# Altium project AVCI_Mk1.PrjPcb (part 1 of 3)
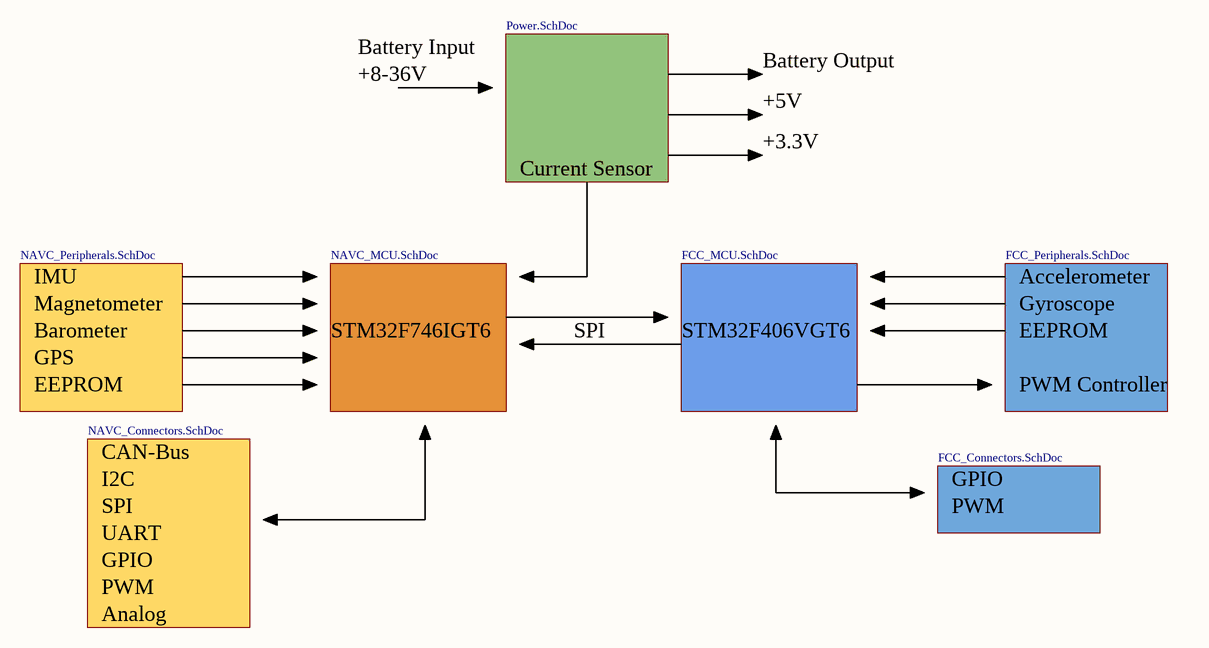
[diagram p0: Overview.SchDoc]
8 sheets, 240 parts. Net scope: flat (ports and power ports of the same name join across sheets).
Board file: AVCI_Mk1.PcbDoc
Sheets:
  Overview.SchDoc
    Designator = FCC_Connectors.SchDoc
    Designator = FCC_Peripherals.SchDoc
    Designator = NAVC_MCU.SchDoc
    Designator = NAVC_Peripherals.SchDoc
    Designator = NAVC_Connectors.SchDoc
    Designator = FCC_MCU.SchDoc
    Designator = Power.SchDoc

## Sheet Overview.SchDoc
size A4; SheetNumber: 1; SheetTotal: 8

### Sub-sheets
Designator = FCC_Connectors.SchDoc: no entries
Designator = FCC_Peripherals.SchDoc: no entries
Designator = NAVC_MCU.SchDoc: no entries
Designator = NAVC_Peripherals.SchDoc: no entries
Designator = NAVC_Connectors.SchDoc: no entries
Designator = FCC_MCU.SchDoc: no entries
Designator = Power.SchDoc: no entries

### Notes on the sheet
- +8-36V
- Battery Input
- +5V
- Battery Output
- Current Sensor
- +3.3V
- IMU
- Magnetometer
- Accelerometer
- Gyroscope
- Barometer
- GPS
- STM32F746IGT6
- SPI
- STM32F406VGT6
- EEPROM
- PWM Controller
- CAN-Bus
- I2C
- GPIO
- PWM
- UART
- Analog

## Sheet FCC_Connectors.SchDoc
size A4; SheetNumber: 7; SheetTotal: 8
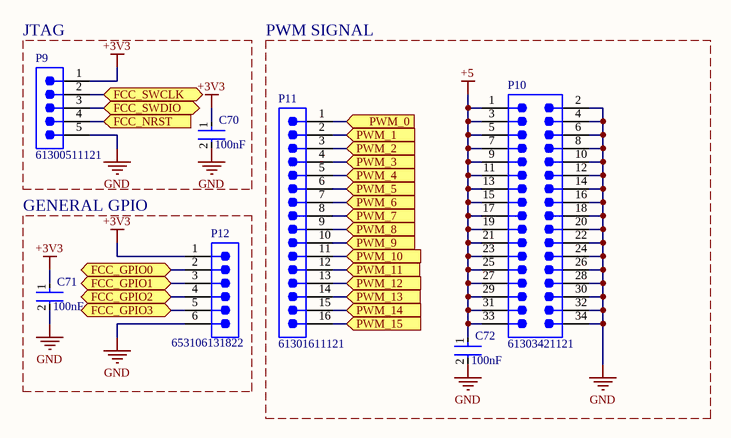
[diagram p1: FCC_Connectors.SchDoc]

### Parts
C70  100nF  [FP-CGA3E-0_3-0_1-IPC_A]
C71  100nF  [FP-CGA3E-0_3-0_1-IPC_A]
C72  100nF  [FP-CGA3E-0_3-0_1-IPC_A]
P9  61300511121  [61300511121]
P10  61303421121  [61303421121]
P11  61301611121  [61301611121]
P12  653106131822  [653106131822]

### Blocks framed on the sheet
JTAG: C70 P9
PWM SIGNAL: C72 P10 P11
GENERAL GPIO: C71 P12

### Ports
FCC_GPIO0 (bidir, see FCC_MCU[2A]), FCC_GPIO1 (bidir, see FCC_MCU[2A]), FCC_GPIO2 (bidir, see FCC_MCU[2A]), FCC_GPIO3 (bidir, see FCC_MCU[2A]), FCC_NRST (in, see FCC_MCU[3C], FCC_MCU[4A]), FCC_SWCLK (bidir, see FCC_MCU[1B]), FCC_SWDIO (bidir, see FCC_MCU[1B]), PWM_0 (in, see FCC_Peripherals[2B]), PWM_1 (in, see FCC_Peripherals[2B]), PWM_2 (in, see FCC_Peripherals[2B]), PWM_3 (in, see FCC_Peripherals[2B]), PWM_4 (in, see FCC_Peripherals[2B]), PWM_5 (in, see FCC_Peripherals[2B]), PWM_6 (in, see FCC_Peripherals[2C]), PWM_7 (in, see FCC_Peripherals[2C]), PWM_8 (in, see FCC_Peripherals[2C]), PWM_9 (in, see FCC_Peripherals[2C]), PWM_10 (in, see FCC_Peripherals[2C]), PWM_11 (in, see FCC_Peripherals[2C]), PWM_12 (in, see FCC_Peripherals[2C]), PWM_13 (in, see FCC_Peripherals[2C]), PWM_14 (in, see FCC_Peripherals[2C]), PWM_15 (in, see FCC_Peripherals[2C])

### Nets
+3V3: C70.1 C71.1 P9.1 P12.1
+5: C72.1 P10.1 P10.3 P10.5 P10.7 P10.9 P10.11 P10.13 P10.15 P10.17 P10.19 P10.21 P10.23 P10.25 P10.27 P10.29 P10.31 P10.33
GND: C70.2 C71.2 C72.2 P9.5 P10.2 P10.4 P10.6 P10.8 P10.10 P10.12 P10.14 P10.16 P10.18 P10.20 P10.22 P10.24 P10.26 P10.28 P10.30 P10.32 P10.34 P12.6
NetC54_1: P9.4 ; port FCC_NRST
NetP9_2: P9.2 ; port FCC_SWCLK
NetP9_3: P9.3 ; port FCC_SWDIO
NetP11_1: P11.1 ; port PWM_0
NetP11_2: P11.2 ; port PWM_1
NetP11_3: P11.3 ; port PWM_2
NetP11_4: P11.4 ; port PWM_3
NetP11_5: P11.5 ; port PWM_4
NetP11_6: P11.6 ; port PWM_5
NetP11_7: P11.7 ; port PWM_6
NetP11_8: P11.8 ; port PWM_7
NetP11_9: P11.9 ; port PWM_8
NetP11_10: P11.10 ; port PWM_9
NetP11_11: P11.11 ; port PWM_10
NetP11_12: P11.12 ; port PWM_11
NetP11_13: P11.13 ; port PWM_12
NetP11_14: P11.14 ; port PWM_13
NetP11_15: P11.15 ; port PWM_14
NetP11_16: P11.16 ; port PWM_15
NetP12_2: P12.2 ; port FCC_GPIO0
NetP12_3: P12.3 ; port FCC_GPIO1
NetP12_4: P12.4 ; port FCC_GPIO2
NetP12_5: P12.5 ; port FCC_GPIO3

### Library data of the parts
C70-C72 = CMP-2000-07546-2: Cap Ceramic 100nF 50V X7R 10% Pad SMD 0603 +125°C Automotive T/R; Weight: 7.1E-05oz; Composition: Ceramic; Max Operating Temperature: 125°C; Termination: SMD/SMT; Dielectric: X7R; Length: 1.6mm; Package Quantity: 1; REACH SVHC: No SVHC; Lead Free: Lead Free; Case Code (Metric): 1608; Min Operating Temperature: -55°C; Packaging: Tape and Reel; Tolerance: 10%; Voltage Rating: 50V; Case Code (Imperial): 0603; Capacitance: 100nF; Case/Package: 0603; Voltage Rating (DC): 50V; Depth: 0.8mm; Radiation Hardening: No; Ratings: AEC-Q200; Mount: Surface Mount; Voltage: 50V; Thickness: 0.035inch; Width: 0.8mm; Height: 0.8mm
P9 = CMP-1502-01068-3: NexarPartId: 32855526; Connector Type: Male Pin; Gender: Male; Contact Resistance: 20mΩ; Pitch: 2.54mm; Operating Supply Voltage: 250V; Current Rating: 3A; Number of Contacts: 5; Lead Free: Lead Free; Color: Black; Packaging: Bulk; Lead Pitch: 2.54mm; Contact Material: Copper; Min Operating Temperature: -40°C; Contact Mating Length: 5.9944mm; Voltage Rating: 250V; Number of Pins: 5; Number of Positions: 5; Height: 8.89mm; Orientation: Vertical; REACH SVHC: Unknown; RoHS: Compliant; Contact Plating: Gold; Max Operating Temperature: 105°C; Mount: Through Hole; Number of Rows: 1; Termination: Solder
P10 = CMP-1502-01127-3: NexarPartId: 32855572; Operating Supply Voltage: 250V; Number of Positions: 34; Pitch: 2.54mm; Contact Resistance: 20mΩ; Connector Type: Male Pin; Gender: Male; Current Rating: 3A; Termination: Solder; Packaging: Bulk; Number of Rows: 2; Contact Plating: Gold; Contact Material: Copper; Orientation: Vertical; Number of Contacts: 34; REACH SVHC: Unknown; RoHS: Compliant; Lead Pitch: 2.54mm; Contact Mating Length: 5.9944mm; Color: Black; Row Spacing: 2.54mm; Mount: Through Hole; Number of Pins: 34
P11 = CMP-1502-01095-4: NexarPartId: 32855548; Voltage Rating: 250V; Connector Type: Male Pin; Current Rating: 3A; Contact Resistance: 20mΩ; Number of Contacts: 16; Gender: Male; Pitch: 2.54mm; Min Operating Temperature: -40°C; Termination: Solder; Height: 8.89mm; Contact Plating: Gold; Packaging: Bulk; Contact Material: Copper; Mount: Through Hole; Number of Rows: 1; Contact Mating Length: 5.9944mm; Operating Supply Voltage: 250V; RoHS: Compliant; Max Operating Temperature: 105°C; Lead Pitch: 2.54mm; Color: Black; Number of Pins: 16; Number of Positions: 16; REACH SVHC: Unknown; Orientation: Vertical
P12 = CMP-1502-00775-2: NexarPartId: 116856464; Insulation Resistance: 100MΩ; Current Rating: 1A; Gender: Male; Pitch: 1.25mm; Min Operating Temperature: -40°C; Packaging: Tape and Reel; Length: 12.25mm; Contact Plating: Tin; Max Operating Temperature: 85°C; Number of Pins: 6; RoHS: Compliant

## Sheet FCC_Peripherals.SchDoc
size A4; SheetNumber: 6; SheetTotal: 8
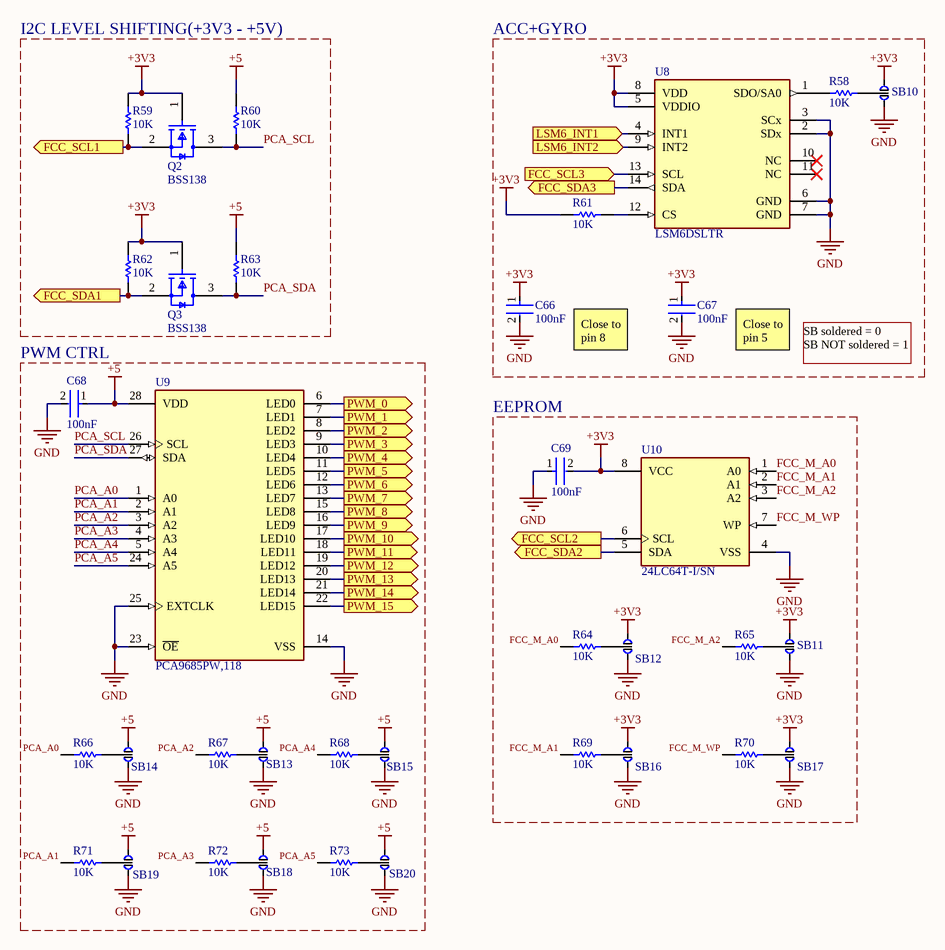
[diagram p2: FCC_Peripherals.SchDoc]

### Parts
C66  100nF  [FP-CGA3E-0_3-0_1-IPC_A]
C67  100nF  [FP-CGA3E-0_3-0_1-IPC_A]
C68  100nF  [FP-CGA3E-0_3-0_1-IPC_A]
C69  100nF  [FP-CGA3E-0_3-0_1-IPC_A]
Q2  BSS138  [FP-318-08-IPC_B]
Q3  BSS138  [FP-318-08-IPC_B]
R58  10K  [RESC1608X55X25ML10T15]
R59  10K  [RESC1608X55X25ML10T15]
R60  10K  [RESC1608X55X25ML10T15]
R61  10K  [RESC1608X55X25ML10T15]
R62  10K  [RESC1608X55X25ML10T15]
R63  10K  [RESC1608X55X25ML10T15]
R64  10K  [RESC1608X55X25ML10T15]
R65  10K  [RESC1608X55X25ML10T15]
R66  10K  [RESC1608X55X25ML10T15]
R67  10K  [RESC1608X55X25ML10T15]
R68  10K  [RESC1608X55X25ML10T15]
R69  10K  [RESC1608X55X25ML10T15]
R70  10K  [RESC1608X55X25ML10T15]
R71  10K  [RESC1608X55X25ML10T15]
R72  10K  [RESC1608X55X25ML10T15]
R73  10K  [RESC1608X55X25ML10T15]
SB10  Solderbridge3P  [SolderBridge3P]  (value not drawn)
SB11  Solderbridge3P  [SolderBridge3P]  (value not drawn)
SB12  Solderbridge3P  [SolderBridge3P]  (value not drawn)
SB13  Solderbridge3P  [SolderBridge3P]  (value not drawn)
SB14  Solderbridge3P  [SolderBridge3P]  (value not drawn)
SB15  Solderbridge3P  [SolderBridge3P]  (value not drawn)
SB16  Solderbridge3P  [SolderBridge3P]  (value not drawn)
SB17  Solderbridge3P  [SolderBridge3P]  (value not drawn)
SB18  Solderbridge3P  [SolderBridge3P]  (value not drawn)
SB19  Solderbridge3P  [SolderBridge3P]  (value not drawn)
SB20  Solderbridge3P  [SolderBridge3P]  (value not drawn)
U8  LSM6DSLTR  [FP-LGA-14L-DM00249496-MFG]
U9  PCA9685PW,118  [FP-SOT361-1-MFG]
U10  24LC64T-I/SN  [FP-C04-057-SN-MFG]

### Blocks framed on the sheet
I2C LEVEL SHIFTING(+3V3 - +5V): Q2 Q3 R59 R60 R62 R63
ACC+GYRO: C66 C67 R58 R61 SB10 U8
PWM CTRL: C68 R66-R68 R71-R73 SB13-SB15 SB18-SB20 U9
EEPROM: C69 R64 R65 R69 R70 SB11 SB12 SB16 SB17 U10

### Ports
FCC_SCL1 (out, see FCC_MCU[1B]), FCC_SCL2 (out, see FCC_MCU[1B], FCC_MCU[3C]), FCC_SCL3 (in, see FCC_MCU[1A], FCC_MCU[3C]), FCC_SDA1 (out, see FCC_MCU[1B]), FCC_SDA2 (out, see FCC_MCU[1B], FCC_MCU[3C]), FCC_SDA3 (out, see FCC_MCU[2A], FCC_MCU[3C]), LSM6_INT1 (in, see FCC_MCU[1A]), LSM6_INT2 (in, see FCC_MCU[1A]), PWM_0 (out, see FCC_Connectors[1A]), PWM_1 (out, see FCC_Connectors[1A]), PWM_2 (out, see FCC_Connectors[1A]), PWM_3 (out, see FCC_Connectors[1A]), PWM_4 (out, see FCC_Connectors[1A]), PWM_5 (out, see FCC_Connectors[1A]), PWM_6 (out, see FCC_Connectors[1A]), PWM_7 (out, see FCC_Connectors[1A]), PWM_8 (out, see FCC_Connectors[1A]), PWM_9 (out, see FCC_Connectors[1B]), PWM_10 (out, see FCC_Connectors[1B]), PWM_11 (out, see FCC_Connectors[1B]), PWM_12 (out, see FCC_Connectors[1B]), PWM_13 (out, see FCC_Connectors[1B]), PWM_14 (out, see FCC_Connectors[1B]), PWM_15 (out, see FCC_Connectors[1B])

### Nets
+3V3: C66.1 C67.1 C69.2 Q2.1(G) Q3.1(G) R59.2 R61.1 R62.2 SB10.1 SB11.1 SB12.1 SB16.1 SB17.1 U8.5(VDDIO) U8.8(VDD) U10.8(VCC)
+5: C68.1 R60.2 R63.2 SB13.1 SB14.1 SB15.1 SB18.1 SB19.1 SB20.1 U9.28(VDD)
GND: C66.2 C67.2 C68.2 C69.1 SB10.2 SB11.2 SB12.2 SB13.2 SB14.2 SB15.2 SB16.2 SB17.2 SB18.2 SB19.2 SB20.2 U8.2(SDx) U8.3(SCx) U8.6(GND) U8.7(GND) U9.14(VSS) U9.23(~{OE}) U9.25(EXTCLK) U10.4(VSS)
FCC_M_A0: R64.2 U10.1(A0)
FCC_M_A1: R69.2 U10.2(A1)
FCC_M_A2: R65.2 U10.3(A2)
FCC_M_WP: R70.2 U10.7(WP)
PCA_A0: R66.1 U9.1(A0)
PCA_A1: R71.1 U9.2(A1)
PCA_A2: R67.1 U9.3(A2)
PCA_A3: R72.1 U9.4(A3)
PCA_A4: R68.1 U9.5(A4)
PCA_A5: R73.1 U9.24(A5)
PCA_SCL: Q2.3(D) R60.1 U9.26(SCL)
PCA_SDA: Q3.3(D) R63.1 U9.27(SDA)
NetP11_1: U9.6(LED0) ; port PWM_0
NetP11_2: U9.7(LED1) ; port PWM_1
NetP11_3: U9.8(LED2) ; port PWM_2
NetP11_4: U9.9(LED3) ; port PWM_3
NetP11_5: U9.10(LED4) ; port PWM_4
NetP11_6: U9.11(LED5) ; port PWM_5
NetP11_7: U9.12(LED6) ; port PWM_6
NetP11_8: U9.13(LED7) ; port PWM_7
NetP11_9: U9.15(LED8) ; port PWM_8
NetP11_10: U9.16(LED9) ; port PWM_9
NetP11_11: U9.17(LED10) ; port PWM_10
NetP11_12: U9.18(LED11) ; port PWM_11
NetP11_13: U9.19(LED12) ; port PWM_12
NetP11_14: U9.20(LED13) ; port PWM_13
NetP11_15: U9.21(LED14) ; port PWM_14
NetP11_16: U9.22(LED15) ; port PWM_15
NetQ2_2: Q2.2(S) R59.1 ; port FCC_SCL1
NetQ3_2: Q3.2(S) R62.1 ; port FCC_SDA1
NetR48_1: U8.4(INT1) ; port LSM6_INT1
NetR49_1: U8.9(INT2) ; port LSM6_INT2
NetR51_1: U10.6(SCL) ; port FCC_SCL2
NetR52_1: U10.5(SDA) ; port FCC_SDA2
NetR53_1: U8.13(SCL) ; port FCC_SCL3
NetR54_1: U8.14(SDA) ; port FCC_SDA3
NetR58_1: R58.1 U8.1(SDO/SA0)
NetR58_2: R58.2 SB10.3
NetR61_2: R61.2 U8.12(CS)
NetR64_1: R64.1 SB12.3
NetR65_1: R65.1 SB11.3
NetR66_2: R66.2 SB14.3
NetR67_2: R67.2 SB13.3
NetR68_2: R68.2 SB15.3
NetR69_1: R69.1 SB16.3
NetR70_1: R70.1 SB17.3
NetR71_2: R71.2 SB19.3
NetR72_2: R72.2 SB18.3
NetR73_2: R73.2 SB20.3

Not connected (* = marked no-connect by the designer): U8 10(NC)* 11(NC)*

### Notes on the sheet
- Close to pin 8
- Close to pin 5
- SB soldered = 0
  SB NOT soldered = 1

### Library data of the parts
C66-C69 = CMP-2000-07546-2: as C70 on sheet FCC_Connectors; Weight: 7.1E-05oz; Composition: Ceramic; Max Operating Temperature: 125°C; Termination: SMD/SMT; Dielectric: X7R; Length: 1.6mm; Package Quantity: 1; REACH SVHC: No SVHC; Lead Free: Lead Free; Case Code (Metric): 1608; Min Operating Temperature: -55°C; Packaging: Tape and Reel; Tolerance: 10%; Voltage Rating: 50V; Case Code (Imperial): 0603; Capacitance: 100nF; Case/Package: 0603; Voltage Rating (DC): 50V; Depth: 0.8mm; Radiation Hardening: No; Ratings: AEC-Q200; Mount: Surface Mount; Voltage: 50V; Thickness: 0.035inch; Width: 0.8mm; Height: 0.8mm
Q2 Q3 = CMP-07173-000101-1: MOSFET N-CH 50V 220MA SOT-23; Turn-Off Delay Time: 20ns; Element Configuration: Single; Rds On Max: 3.5R; Gate to Source Voltage (Vgs): 20V; Threshold Voltage: 1.3V; Number of Elements: 1; Power Dissipation: 360mW; Rise Time: 9ns; Turn-On Delay Time: 2.5ns; Input Capacitance: 27pF; On-State Resistance: 6R; Lead Free: Lead Free; Length: 2.92mm; Width: 1.3mm; Drain to Source Breakdown Voltage: 50V; Min Operating Temperature: -55°C; REACH SVHC: No SVHC; Packaging: Tape and Reel; Radiation Hardening: No; Height: 0.93mm; Drain to Source Voltage (Vdss): 50V; Current Rating: 220mA; Voltage Rating (DC): 50V; Weight: 0.03g; Continuous Drain Current (ID): 220mA; Number of Pins: 3; Nominal Vgs: 1.3V; Max Power Dissipation: 360mW; Fall Time: 9ns; Drain to Source Resistance: 3.5R; Contact Plating: Tin; Case/Package: SOT-23; Package Quantity: 1; Dual Supply Voltage: 50V; Mount: Surface Mount; Termination: SMD/SMT; Max Operating Temperature: 150°C
R58-R73 = CMP-2100-03667-1: Chip Resistor, 0 Ohm, +/- 5%, 0.1 W, -55 to 155 degC, 0603 (1608 Metric), RoHS, Tape and Reel; Manufacturer: Yageo; Temperature Coefficient: 200ppm/degreesC; Voltage Rating: 50V; Power Rating: 100mW; Resistance: 0mOhm; Width: 0.8mm; Max Operating Temperature: 155degC; Tolerance: 5%; Package Reference: 0603; Height: 0.45mm; Depth: 0.8mm; Package Description: 2-Pin Surface Mount Device, Body 1.6 x 0.8 mm; Termination: SMD/SMT; Package Quantity: 5000; Case/Package: 0603; Case Code (Imperial): 0603; Radiation Hardening: No; Number of Pins: 2; Length: 1.6mm; Lead Free: LeadFree; Voltage Rating (DC): 50V; Military Standard: Not; Datasheet URL: http://www.yageo.com/NewPortal/yageodocoutput?fileName=/pdf/R-Chip/PYu-RC_Group_51_RoHS_L_5.pdf; Manufacturer URL: http://www.yageo.com/; Packaging: TapeandReel; Case Code (Metric): 1608; Min Operating Temperature: -55degC; Composition: ThickFilm; RoHSCompliant: true; Contact Plating: Tin; Datasheet Version: Rev. 5, 10/2016; REACH SVHC: NoSVHC
U8 = CMP-2000-07467-2: IMU ACCEL/GYRO I2C/SPI 14LGA; Manufacturer: STMicroelectronics; Resolution: 16bits; Max Supply Voltage: 3.6V; Sensor Type: Temperature,Accelerometer,Gyroscope; Sensor Output: I2C,SPI; Gyro Range: 125/250/500/1000/2000°/s; Accel Range: 2/4/8/16g; Operating Supply Current: 0.29-0.65mA; Min Supply Voltage: 1.62V; Package: LGA-14L-DM00249496; Temperature Range High: +85°C; Automotive: No; Footprint Url: https://www.st.com/resource/en/technical_note/cd00134799.pdf; Height: 0.86mm; Device Class L1: Sensors; Octopart: https://octopart.com/lsm6dsltr-stmicroelectronics-66358193; Device Class L2: Motion Sensors; Lead Free: Yes; Category: IC; Device Class L3: Inertial Measurement Units (IMUs); ComponentLink2Description: Datasheet; RoHS: TRUE; ComponentLink2URL: https://www.st.com/resource/en/datasheet/lsm6dsl.pdf; Temperature Range Low: -40°C; Manufacturer Part Number: LSM6DSLTR; Mouser Description: iNEMO inertial module: always-on 3D accelerometer and 3D gyroscope; Digikey Description: IMU ACCEL/GYRO I2C/SPI 14LGA; Temperature: -40°C to +85°C
U9 = CMP-1595-00003-3: IC LED DRIVER RGBA 28-TSSOP; Manufacturer: NXP Semiconductors; Max Power Dissipation: 400mW; Dimming: I2C,PWM; Number Of Outputs: 16; Import Ts: 1521846855; Min Supply Voltage: 2.3V; Max Supply Voltage: 5.5V; Output Voltage: 5V; Nominal Supply Current: 6mA; Standoff Height: 0.05mm; Output Current: 25mA; Ciiva Ids: 1426473; Temperature Range Low: -40°C; Footprint Url: https://www.nxp.com/docs/en/package-information/SOT361-1.pdf; Height: 1.1mm; Manufacturer Part Number: PCA9685PW,118; Device Class L2: Power Management ICs; Temperature: -40°C to +85°C; Temperature Range High: +85°C; Digikey Description: IC LED DRIVER RGBA 28-TSSOP; ComponentLink2Description: Datasheet; Device Class L3: LED Drivers; Ambient Temperature Range Low: -40°C; ComponentLink2URL: https://www.nxp.com/docs/en/data-sheet/PCA9685.pdf; Ambient Temperature Range High: +85°C; Device Class L1: Integrated Circuits (ICs); Mouser Description: LED Display Drivers I2C Bus LED Controller 28-Pin; Octopart: https://octopart.com/pca9685pw%2C118-nxp+semiconductors-11853435; Release Date: 1454319143; Lead Free: Yes; Category: IC; RoHS: TRUE; Package: SOT361-1; Automotive: No
U10 = CMP-0159-00199-2: IC EEPROM 64K I2C 400KHZ 8SOIC; Manufacturer: Microchip Technology; Min Supply Voltage: 2.5V; Interface: I2C,2-Wire; Access Time: 900ns; Memory Size: 64Kbits; Max Supply Voltage: 5.5V; Nominal Supply Current: 0.05-100uA; Standoff Height: 0.1mm; Temperature: -40°C to +85°C; Automotive: No; Ambient Temperature Range Low: -40°C; Device Class L1: Integrated Circuits (ICs); Footprint 1 Description: SOIC, 8-Leads, Body 4.9x3.8mm, Pitch 1.27mm, IPC High Density; Octopart: https://octopart.com/24lc64t-i%2Fsn-microchip-451854; Footprint Url: http://ww1.microchip.com/downloads/en/DeviceDoc/08L_SOIC_150_3dot9mm_SN_C04-00057e.pdf; Footprint 0 Description: SOIC, 8-Leads, Body 4.9x3.8mm, Pitch 1.27mm, IPC Medium Density; Memory Type: EEPROM; ComponentLink2Description: Datasheet; Digikey Description: IC EEPROM 64K I2C 400KHZ 8SOIC; Manufacturer Part Number: 24LC64T-I/SN; Temperature Range Low: -40°C; Footprint 2 Description: SOIC, 8-Leads, Body 4.9x3.8mm, Pitch 1.27mm, IPC Low Density; ComponentLink2URL: http://ww1.microchip.com/downloads/en/DeviceDoc/21189T.pdf; RoHS: TRUE; Device Class L2: Memory; Ambient Temperature Range High: +85°C; Mouser Description: EEPROM 8kx8 - 2.5V; Lead Free: Yes; Temperature Range High: +85°C; Frequency: 400kHz; Height: 1.75mm; Package: C04-057-SN; Ipc Land Pattern Name: SOIC127P600X175-8; Category: IC; Device Class L3: EEPROM

## Sheet NAVC_MCU.SchDoc
size A4; SheetNumber: 2; SheetTotal: 8
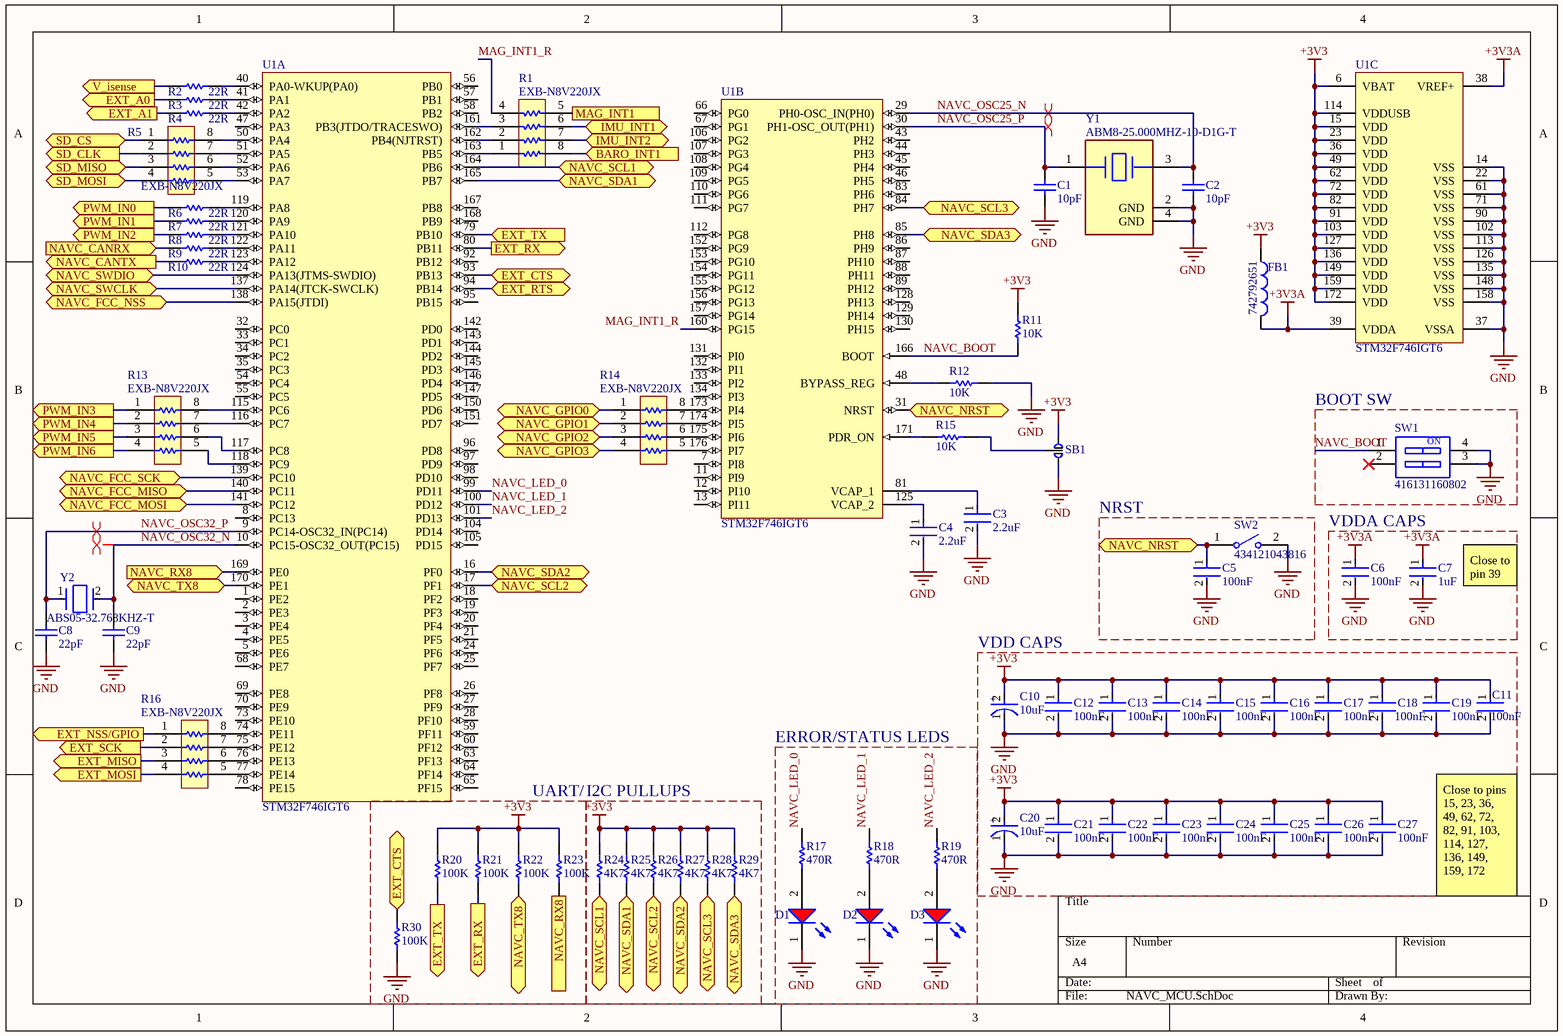
[diagram p3: NAVC_MCU.SchDoc]

### Parts
C1  10pF  [CAPC1608X90X35LL10T15]
C2  10pF  [CAPC1608X90X35LL10T15]
C3  2.2uF  [FP-CGA3E-0_3-0_1-IPC_A]
C4  2.2uF  [FP-CGA3E-0_3-0_1-IPC_A]
C5  100nF  [FP-CGA3E-0_3-0_1-IPC_A]
C6  100nF  [FP-CGA3E-0_3-0_1-IPC_A]
C7  1uF  [FP-CGA3E-0_3-0_1-IPC_A]
C8  22pF  [CAPC1608X90X35ML10T15]
C9  22pF  [CAPC1608X90X35ML10T15]
C10  10uF  [FP-T491A106K006AT-MFG]
C11  100nF  [FP-CGA3E-0_3-0_1-IPC_A]
C12  100nF  [FP-CGA3E-0_3-0_1-IPC_A]
C13  100nF  [FP-CGA3E-0_3-0_1-IPC_A]
C14  100nF  [FP-CGA3E-0_3-0_1-IPC_A]
C15  100nF  [FP-CGA3E-0_3-0_1-IPC_A]
C16  100nF  [FP-CGA3E-0_3-0_1-IPC_A]
C17  100nF  [FP-CGA3E-0_3-0_1-IPC_A]
C18  100nF  [FP-CGA3E-0_3-0_1-IPC_A]
C19  100nF  [FP-CGA3E-0_3-0_1-IPC_A]
C20  10uF  [FP-T491A106K006AT-MFG]
C21  100nF  [FP-CGA3E-0_3-0_1-IPC_A]
C22  100nF  [FP-CGA3E-0_3-0_1-IPC_A]
C23  100nF  [FP-CGA3E-0_3-0_1-IPC_A]
C24  100nF  [FP-CGA3E-0_3-0_1-IPC_A]
C25  100nF  [FP-CGA3E-0_3-0_1-IPC_A]
C26  100nF  [FP-CGA3E-0_3-0_1-IPC_A]
C27  100nF  [FP-CGA3E-0_3-0_1-IPC_A]
D1  150120SS75000  [WL-SMCW_1206_150120xx75000]  (value not drawn)
D2  150120SS75000  [WL-SMCW_1206_150120xx75000]  (value not drawn)
D3  150120SS75000  [WL-SMCW_1206_150120xx75000]  (value not drawn)
FB1  742792651  [WE-CBF_0603_L1.6W0.8H0.8_HC]
R1  EXB-N8V220JX  [BOUR-CAT10_V]
R2  22R  [RESC1608X55X25ML10T15]
R3  22R  [RESC1608X55X25ML10T15]
R4  22R  [RESC1608X55X25ML10T15]
R5  EXB-N8V220JX  [BOUR-CAT10_V]
R6  22R  [RESC1608X55X25ML10T15]
R7  22R  [RESC1608X55X25ML10T15]
R8  22R  [RESC1608X55X25ML10T15]
R9  22R  [RESC1608X55X25ML10T15]
R10  22R  [RESC1608X55X25ML10T15]
R11  10K  [RESC1608X55X25ML10T15]
R12  10K  [RESC1608X55X25ML10T15]
R13  EXB-N8V220JX  [BOUR-CAT10_V]
R14  EXB-N8V220JX  [BOUR-CAT10_V]
R15  10K  [RESC1608X55X25ML10T15]
R16  EXB-N8V220JX  [BOUR-CAT10_V]
R17  470R  [RESC1609X50X30NL8T20]
R18  470R  [RESC1609X50X30NL8T20]
R19  470R  [RESC1609X50X30NL8T20]
R20  100K  [RESC1608X55X25ML10T15]
R21  100K  [RESC1608X55X25ML10T15]
R22  100K  [RESC1608X55X25ML10T15]
R23  100K  [RESC1608X55X25ML10T15]
R24  4K7  [RESC1608X55X25ML10T15]
R25  4K7  [RESC1608X55X25ML10T15]
R26  4K7  [RESC1608X55X25ML10T15]
R27  4K7  [RESC1608X55X25ML10T15]
R28  4K7  [RESC1608X55X25ML10T15]
R29  4K7  [RESC1608X55X25ML10T15]
R30  100K  [RESC1608X55X25ML10T15]
SB1  Solderbridge3P  [SolderBridge3P]  (value not drawn)
SW1  416131160802  [416131160802]
SW2  434121043816  [434121043816]
U1  STM32F746IGT6  [STM-LQFP176_N]  (parts A,B,C of 3)
Y1  ABM8-25.000MHZ-10-D1G-T  [FP-ABM8-MFG]
Y2  ABS05-32.768KHZ-T  [FP-ABS05-MFG]

### Blocks framed on the sheet
BOOT SW: SW1
NRST: C5 SW2
VDDA CAPS: C6 C7
VDD CAPS: C10-C27
ERROR/STATUS LEDS: D1-D3 R17-R19
UART/: R20-R23 R30
I2C PULLUPS: R24-R29

### Ports
BARO_INT1 (in, see NAVC_Peripherals[4A]), EXT_A0 (out, see NAVC_Connectors[1C]), EXT_A1 (out, see NAVC_Connectors[1C]), EXT_CTS (bidir, see NAVC_Connectors[1B], NAVC_MCU[2B]), EXT_CTS (bidir, see NAVC_Connectors[1B], NAVC_MCU[2D]), EXT_MISO (out, see NAVC_Connectors[1C]), EXT_MOSI (out, see NAVC_Connectors[1C]), EXT_NSS/GPIO (out, see NAVC_Connectors[1C]), EXT_RTS (bidir, see NAVC_Connectors[1B]), EXT_RX (out, see NAVC_Connectors[1B], NAVC_MCU[2A]), EXT_RX (out, see NAVC_Connectors[1B], NAVC_MCU[2D]), EXT_SCK (out, see NAVC_Connectors[1C]), EXT_TX (in, see NAVC_Connectors[1B], NAVC_MCU[2D]), EXT_TX (out, see NAVC_Connectors[1B], NAVC_MCU[2A]), IMU_INT1 (bidir, see NAVC_Peripherals[1A]), IMU_INT2 (bidir, see NAVC_Peripherals[2A]), MAG_INT1 (in, see NAVC_Peripherals[3A]), NAVC_CANRX (in, see NAVC_Peripherals[1D]), NAVC_CANTX (out, see NAVC_Peripherals[1D]), NAVC_FCC_MISO (bidir, see FCC_MCU[1A]), NAVC_FCC_MOSI (bidir, see FCC_MCU[1A]), NAVC_FCC_NSS (bidir, see FCC_MCU[1A]), NAVC_FCC_SCK (bidir, see FCC_MCU[1A]), NAVC_GPIO0 (bidir, see NAVC_Connectors[2B]), NAVC_GPIO1 (bidir, see NAVC_Connectors[2B]), NAVC_GPIO2 (bidir, see NAVC_Connectors[2B]), NAVC_GPIO3 (bidir, see NAVC_Connectors[2B]), NAVC_NRST (bidir, see NAVC_Connectors[1A], NAVC_MCU[3B]), NAVC_NRST (bidir, see NAVC_Connectors[1A], NAVC_MCU[3C]), NAVC_RX8 (in, see NAVC_MCU[2D], NAVC_Peripherals[2C]), NAVC_RX8 (out, see NAVC_MCU[1C], NAVC_Peripherals[2C]), NAVC_SCL1 (bidir, see NAVC_MCU[2A], NAVC_Peripherals[2A], NAVC_Peripherals[3A]), NAVC_SCL1 (bidir, see NAVC_MCU[2D], NAVC_Peripherals[2A], NAVC_Peripherals[3A]), NAVC_SCL2 (bidir, see NAVC_MCU[2C], NAVC_Peripherals[2B], NAVC_Peripherals[3C]), NAVC_SCL2 (bidir, see NAVC_MCU[2D], NAVC_Peripherals[2B], NAVC_Peripherals[3C]), NAVC_SCL3 (bidir, see NAVC_Connectors[1B], NAVC_MCU[2D]), NAVC_SCL3 (bidir, see NAVC_Connectors[1B], NAVC_MCU[3A]), NAVC_SDA1 (bidir, see NAVC_MCU[2A], NAVC_Peripherals[2A], NAVC_Peripherals[3A]), NAVC_SDA1 (bidir, see NAVC_MCU[2D], NAVC_Peripherals[2A], NAVC_Peripherals[3A]), NAVC_SDA2 (bidir, see NAVC_MCU[2C], NAVC_Peripherals[2B], NAVC_Peripherals[3C]), NAVC_SDA2 (bidir, see NAVC_MCU[2D], NAVC_Peripherals[2B], NAVC_Peripherals[3C]), NAVC_SDA3 (bidir, see NAVC_Connectors[1B], NAVC_MCU[2D]), NAVC_SDA3 (bidir, see NAVC_Connectors[1B], NAVC_MCU[3A]), NAVC_SWCLK (bidir, see NAVC_Connectors[1A]), NAVC_SWDIO (bidir, see NAVC_Connectors[1A]), NAVC_TX8 (bidir, see NAVC_MCU[1C], NAVC_Peripherals[2C]), NAVC_TX8 (bidir, see NAVC_MCU[2D], NAVC_Peripherals[2C]), PWM_IN0 (out, see NAVC_Connectors[2A]), PWM_IN1 (out, see NAVC_Connectors[2A]), PWM_IN2 (out, see NAVC_Connectors[2A]), PWM_IN3 (out, see NAVC_Connectors[2A]), PWM_IN4 (out, see NAVC_Connectors[2A]), PWM_IN5 (out, see NAVC_Connectors[2A]), PWM_IN6 (out, see NAVC_Connectors[2A]), SD_CLK (out, see NAVC_Connectors[2A]), SD_CS (bidir, see NAVC_Connectors[2A]), SD_MISO (bidir, see NAVC_Connectors[2A]), SD_MOSI (bidir, see NAVC_Connectors[2A]), V_isense (out, see Power[2B])

### Nets
+3V3: C10.2(A) C11.1 C12.1 C13.1 C14.1 C15.1 C16.1 C17.1 C18.1 C19.1 C20.2(A) C21.1 C22.1 C23.1 C24.1 C25.1 C26.1 C27.1 FB1.1 R11.1 R20.2 R21.2 R22.2 R23.2 R24.2 R25.2 R26.2 R27.2 R28.2 R29.2 SB1.1 U1.6(VBAT) U1.15(VDD) U1.23(VDD) U1.36(VDD) U1.49(VDD) U1.62(VDD) U1.72(VDD) U1.82(VDD) U1.91(VDD) U1.103(VDD) U1.114(VDDUSB) U1.127(VDD) U1.136(VDD) U1.149(VDD) U1.159(VDD) U1.172(VDD)
+3V3A: C6.1 C7.1 FB1.2 U1.38(VREF+) U1.39(VDDA)
GND: C1.1 C2.1 C3.2 C4.2 C5.2 C6.2 C7.2 C8.1 C9.1 C10.1(C) C11.2 C12.2 C13.2 C14.2 C15.2 C16.2 C17.2 C18.2 C19.2 C20.1(C) C21.2 C22.2 C23.2 C24.2 C25.2 C26.2 C27.2 D1.1(K) D2.1(K) D3.1(K) R12.1 R30.1 SB1.2 SW1.3 SW1.4 SW2.2 U1.14(VSS) U1.22(VSS) U1.37(VSSA) U1.61(VSS) U1.71(VSS) U1.90(VSS) U1.102(VSS) U1.113(VSS) U1.126(VSS) U1.135(VSS) U1.148(VSS) U1.158(VSS) Y1.2(GND) Y1.4(GND)
MAG_INT1_R: R1.4 U1.160(PG15)
NAVC_BOOT: R11.2 SW1.1 U1.166(BOOT)
NAVC_LED_0: R17.1 U1.99(PD11)
NAVC_LED_1: R18.1 U1.100(PD12)
NAVC_LED_2: R19.1 U1.101(PD13)
NAVC_OSC25_N: C2.2 U1.29(PH0-OSC_IN(PH0)) Y1.3
NAVC_OSC25_P: C1.2 U1.30(PH1-OSC_OUT(PH1)) Y1.1
NAVC_OSC32_N: C9.2 U1.10(PC15-OSC32_OUT(PC15)) Y2.2
NAVC_OSC32_P: C8.2 U1.9(PC14-OSC32_IN(PC14)) Y2.1
NetC3_1: C3.1 U1.81(VCAP_1)
NetC4_1: C4.1 U1.125(VCAP_2)
NetC5_1: C5.1 SW2.1 U1.31(NRST) ; port NAVC_NRST
NetC82_1: R2.1 ; port V_isense
NetD1_2: D1.2(A) R17.2
NetD2_2: D2.2(A) R18.2
NetD3_2: D3.2(A) R19.2
NetJ2_2: R5.1 ; port SD_CS
NetJ2_3: R5.4 ; port SD_MOSI
NetJ2_5: R5.2 ; port SD_CLK
NetJ2_7: R5.3 ; port SD_MISO
NetMD1_2: R23.1 U1.169(PE0) ; port NAVC_RX8
NetMD1_3: R22.1 U1.170(PE1) ; port NAVC_TX8
NetMD1_16: R27.1 U1.16(PF0) ; port NAVC_SDA2
NetMD1_17: R26.1 U1.17(PF1) ; port NAVC_SCL2
NetP1_2: U1.137(PA14(JTCK-SWCLK)) ; port NAVC_SWCLK
NetP1_3: U1.124(PA13(JTMS-SWDIO)) ; port NAVC_SWDIO
NetP2_2: R6.1 ; port PWM_IN0
NetP2_3: R7.1 ; port PWM_IN1
NetP2_4: R8.1 ; port PWM_IN2
NetP2_5: R13.1 ; port PWM_IN3
NetP2_6: R13.2 ; port PWM_IN4
NetP2_7: R13.3 ; port PWM_IN5
NetP2_8: R13.4 ; port PWM_IN6
NetP3_2: R28.1 U1.84(PH7) ; port NAVC_SCL3
NetP3_3: R29.1 U1.85(PH8) ; port NAVC_SDA3
NetP4_2: R20.1 U1.79(PB10) ; port EXT_TX
NetP4_3: R21.1 U1.80(PB11) ; port EXT_RX
NetP4_4: R30.2 U1.93(PB13) ; port EXT_CTS
NetP4_5: U1.94(PB14) ; port EXT_RTS
NetP5_2: R14.1 ; port NAVC_GPIO0
NetP5_3: R14.2 ; port NAVC_GPIO1
NetP5_4: R14.3 ; port NAVC_GPIO2
NetP5_5: R14.4 ; port NAVC_GPIO3
NetP7_2: R16.2 ; port EXT_SCK
NetP7_3: R16.3 ; port EXT_MISO
NetP7_4: R16.4 ; port EXT_MOSI
NetP7_5: R16.1 ; port EXT_NSS/GPIO
NetP8_2: R3.1 ; port EXT_A0
NetP8_3: R4.1 ; port EXT_A1
NetR1_1: R1.1 U1.163(PB5)
NetR1_2: R1.2 U1.162(PB4(NJTRST))
NetR1_3: R1.3 U1.161(PB3(JTDO/TRACESWO))
NetR1_5: R1.5 ; port MAG_INT1
NetR1_6: R1.6 ; port IMU_INT1
NetR1_7: R1.7 ; port IMU_INT2
NetR1_8: R1.8 ; port BARO_INT1
NetR2_2: R2.2 U1.40(PA0-WKUP(PA0))
NetR3_2: R3.2 U1.41(PA1)
NetR4_2: R4.2 U1.42(PA2)
NetR5_5: R5.5 U1.53(PA7)
NetR5_6: R5.6 U1.52(PA6)
NetR5_7: R5.7 U1.51(PA5)
NetR5_8: R5.8 U1.50(PA4)
NetR6_2: R6.2 U1.119(PA8)
NetR7_2: R7.2 U1.120(PA9)
NetR8_2: R8.2 U1.121(PA10)
NetR9_1: R9.1 ; port NAVC_CANRX
NetR9_2: R9.2 U1.122(PA11)
NetR10_1: R10.1 ; port NAVC_CANTX
NetR10_2: R10.2 U1.123(PA12)
NetR12_2: R12.2 U1.48(BYPASS_REG)
NetR13_5: R13.5 U1.118(PC9)
NetR13_6: R13.6 U1.117(PC8)
NetR13_7: R13.7 U1.116(PC7)
NetR13_8: R13.8 U1.115(PC6)
NetR14_5: R14.5 U1.176(PI7)
NetR14_6: R14.6 U1.175(PI6)
NetR14_7: R14.7 U1.174(PI5)
NetR14_8: R14.8 U1.173(PI4)
NetR15_1: R15.1 U1.171(PDR_ON)
NetR15_2: R15.2 SB1.3
NetR16_5: R16.5 U1.77(PE14)
NetR16_6: R16.6 U1.76(PE13)
NetR16_7: R16.7 U1.75(PE12)
NetR16_8: R16.8 U1.74(PE11)
NetR24_1: R24.1 U1.164(PB6) ; port NAVC_SCL1
NetR25_1: R25.1 U1.165(PB7) ; port NAVC_SDA1
NetR46_1: U1.138(PA15(JTDI)) ; port NAVC_FCC_NSS
NetR46_2: U1.139(PC10) ; port NAVC_FCC_SCK
NetR46_3: U1.140(PC11) ; port NAVC_FCC_MISO
NetR46_4: U1.141(PC12) ; port NAVC_FCC_MOSI

Not connected (* = marked no-connect by the designer): SW1 2*; U1 1(PE2) 2(PE3) 3(PE4) 4(PE5) 5(PE6) 7(PI8) 8(PC13) 11(PI9) 12(PI10) 13(PI11) 18(PF2) 19(PF3) 20(PF4) 21(PF5) 24(PF6) 25(PF7) 26(PF8) 27(PF9) 28(PF10) 32(PC0) 33(PC1) 34(PC2) 35(PC3) 43(PH2) 44(PH3) 45(PH4) 46(PH5) 47(PA3) 54(PC4) 55(PC5) 56(PB0) 57(PB1) 58(PB2) 59(PF11) 60(PF12) 63(PF13) 64(PF14) 65(PF15) 66(PG0) 67(PG1) 68(PE7) 69(PE8) 70(PE9) 73(PE10) 78(PE15) 83(PH6) 86(PH9) 87(PH10) 88(PH11) 89(PH12) 92(PB12) 95(PB15) 96(PD8) 97(PD9) 98(PD10) 104(PD14) 105(PD15) 106(PG2) 107(PG3) 108(PG4) 109(PG5) 110(PG6) 111(PG7) 112(PG8) 128(PH13) 129(PH14) 130(PH15) 131(PI0) 132(PI1) 133(PI2) 134(PI3) 142(PD0) 143(PD1) 144(PD2) 145(PD3) 146(PD4) 147(PD5) 150(PD6) 151(PD7) 152(PG9) 153(PG10) 154(PG11) 155(PG12) 156(PG13) 157(PG14) 167(PB8) 168(PB9)

### Layout directives
differential pair: NAVC_OSC25_N, NAVC_OSC25_P, NAVC_OSC32_N, NAVC_OSC32_P

### Notes on the sheet
- (near C7) Close to pin 39
- Close to pins 15, 23, 36, 49, 62, 72, 82, 91, 103, 114, 127, 136, 149, 159, 172
- (in symbol CMP-1433-00002-2) ON
- (in symbol CMP-03017-000032-1) +

### Library data of the parts
C1 C2 = CMP-2006-02592-1: Part Number: GRM1885C1H100JA01D; Manufacturer: Murata
C3-C7 C11-C19 C21-C27 = CMP-2000-07546-2: as C70 on sheet FCC_Connectors; Weight: 7.1E-05oz; Composition: Ceramic; Max Operating Temperature: 125°C; Termination: SMD/SMT; Dielectric: X7R; Length: 1.6mm; Package Quantity: 1; REACH SVHC: No SVHC; Lead Free: Lead Free; Case Code (Metric): 1608; Min Operating Temperature: -55°C; Packaging: Tape and Reel; Tolerance: 10%; Voltage Rating: 50V; Case Code (Imperial): 0603; Capacitance: 100nF; Case/Package: 0603; Voltage Rating (DC): 50V; Depth: 0.8mm; Radiation Hardening: No; Ratings: AEC-Q200; Mount: Surface Mount; Voltage: 50V; Thickness: 0.035inch; Width: 0.8mm; Height: 0.8mm
C8 C9 = CMP-2000-04945-1: Chip Capacitor, 22 pF, +/- 5%, 50 V, -55 to 125 degC, 0603 (1608 Metric), RoHS, Tape and Reel; Manufacturer: Murata; Rated Voltage: 50V; Dielectric: C0G; Capacitance: 22pF; Manufacturer URL: http://www.murata.com/; Datasheet Version: Jul-06; Package Reference: 603; Tolerance (%): ±5%; Case Size/Dimension: 0603; Package Description: 2-Pin Surface Mount Device, Body 1.6 x 0.8 mm; Datasheet URL: https://datasheet.ciiva.com/11786/0900766b807a1cab-11786398.pdf
C10 C20 = CMP-03017-000032-1: CAP TANT 10UF 10% 6.3V 1206; Life (Hours): 2000Hour; Polarity: Polar; Dielectric Material: Tantalum; Leakage Current: 600nA; Dissipation Factor: 6%; ESR (Equivalent Series Resistance): 4R; Lead Free: Lead Free; Features: General Purpose; Length: 3.2mm; Mount: Surface Mount; Number of Pins: 2; RoHS Compliant: Yes; Case/Package: 1206; Width: 1.6mm; Capacitance: 10uF; REACH SVHC: No SVHC; Voltage Rating (DC): 6.3V; Max Operating Temperature: 125°C; Height - Seated (Max): 0.071inch; Termination: SMD/SMT; Radiation Hardening: No; Tolerance: 10%; Min Operating Temperature: -55°C; Lead Pitch: 1.2mm; Voltage: 6.3V; Depth: 1.6mm; Case Code (Imperial): 1206; Case Code (Metric): 3216; Packaging: Tape and Reel; Height: 1.6mm; Voltage Rating: 6.3V; Package Quantity: 1
D1-D3 = CMP-1426-00017-3: Led, Red, 630 Nm, 1.9 V, 30 Ma, 60 Mcd Rohs Compliant: Yes; Forward Current: 100mA; Max Reverse Voltage (DC): 5V; Lens Style: Clear, Rectangular; Viewing Angle: 140°; Luminous Intensity: 60mcd; Peak Wavelength: 645nm; Forward Voltage: 1.9V; Test Current: 20mA; Dominant Wavelength: 630nm; Case Code (Imperial): 1206; Length: 3.2mm; Mount: Surface Mount; Case Code (Metric): 3216; Case/Package: 1206; Min Operating Temperature: -40°C; Width: 1.6mm; Color: Red; Height: 680µm; REACH SVHC: Unknown; Max Operating Temperature: 85°C; Wavelength: 630nm; RoHS: Compliant; Packaging: Tape and Reel
FB1 = CMP-0220-00181-3: NexarPartId: 7864500; RMS Current (Irms): 1A; Number of Lines: 1; Test Frequency: 100MHz; Impedance: 600Ω; Inductance: 360mH; Resistance: 200mΩ; Tolerance: 25%; Case Code (Imperial): 0603; Lead Free: Lead Free; Current Rating: 1A; Height: 800µm; Min Operating Temperature: -55°C; Core Material: Ferrite; REACH SVHC: Unknown; Case/Package: 0603; Weight: 3.997283mg; Mount: Surface Mount; Termination: SMD/SMT; Case Code (Metric): 1608; DC Resistance (DCR): 200mΩ; Series Resistance: 200mΩ; Max Operating Temperature: 125°C; Width: 800µm; Length: 1.6mm; Max DC Current: 1A; RoHS: Compliant; Material: Ferrite; Max Current Rating: 1A; Depth: 800µm; Packaging: Cut Tape (CT)
R1 R5 R13 R14 R16 = CMP-2000-06066-1: Chip Resistor Array, 22 Ohm, +/- 5%, -55 to 125 degC, 8-Pin SMD, RoHS, Tape and Reel; Manufacturer: Bourns; Resistance: 22Ohms; Temperature, Operating: -55to+125°C; Power, Rating: 0.125W; Number of Resistors: 4; Temperature, Coefficent: ±250; Brand/Series: CAT10Series; Circuit: IsolatedArray; Mounting Type: SurfaceMount; Tolerance: ±5%; Datasheet Version: 01/2015; Package Description: 8-Pin Surface Mount Device, Body 2 x 1 mm, Pitch 0.5 mm; Number of Terminals: 8; Dimensions: 0.44x0.039x0.022(2x1x0.55)LxWxHin.(mm); Package Reference: CAT10; Mounting Technology: SurfaceMount; Manufacturer URL: http://www.bourns.com/; Package Type: SMT; Datasheet URL: http://www.bourns.com/docs/Product-Datasheets/CAT10.pdf
R2-R4 R6-R12 R15 R20-R30 = CMP-2100-03667-1: as R58 on sheet FCC_Peripherals; Width: 0.8mm; Max Operating Temperature: 155degC; Tolerance: 5%; Package Reference: 0603; Height: 0.45mm; Depth: 0.8mm; Package Description: 2-Pin Surface Mount Device, Body 1.6 x 0.8 mm; Termination: SMD/SMT; Package Quantity: 5000; Case/Package: 0603; Case Code (Imperial): 0603; Radiation Hardening: No; Number of Pins: 2; Length: 1.6mm; Lead Free: LeadFree; Voltage Rating (DC): 50V; Military Standard: Not; Datasheet URL: http://www.yageo.com/NewPortal/yageodocoutput?fileName=/pdf/R-Chip/PYu-RC_Group_51_RoHS_L_5.pdf; Manufacturer URL: http://www.yageo.com/; Packaging: TapeandReel; Case Code (Metric): 1608; Min Operating Temperature: -55degC; Composition: ThickFilm; RoHSCompliant: true; Contact Plating: Tin; Datasheet Version: Rev. 5, 10/2016; REACH SVHC: NoSVHC
R17-R19 = CMP-2000-03816-5: Chip Resistor, 0 Ohm, Jumper, 100 mW, -55 to 155 degC, 0603 (1608 Metric), RoHS, Tape and Reel; Manufacturer: Vishay Semiconductor; Voltage Rating: 75 V; Package Quantity: 5000; DatasheetVersion: 06/2012; Min Operating Temperature: -55 degC; ComponentLink1URL: http://www.vishay.com/; Mounting Technology: Surface Mount; Height: 0.45 mm; ComponentLink1Description: Manufacturer URL; REACH SVHC: Unknown; PackageReference: 0603; Packaging: Tape and Reel; Max Operating Temperature: 155 degC; Mount: Surface Mount; ComponentLink2Description: Datasheet; PackageDescription: 2-Pin Surface Mount Device, Body 1.575 x 0.85 mm; Length: 1.55 mm; ComponentLink2URL: http://www.vishay.com/docs/20035/dcrcwe3.pdf; Pins: 2; RoHSCompliant: true
SW1 = CMP-1433-00002-2: NexarPartId: 19787098; Number of Circuits: 2; Throw Configuration: SPST; Voltage Rating (DC): 24V; Body Material: Polyphenylene; Mechanical Life: 2kcycles; Insulation Resistance: 100MΩ; Current Rating: 25mA; Electrical Life: 1kcycles; Washable: Yes; Contact Resistance: 50mΩ; Pitch: 1.27mm; Max Operating Temperature: 85°C; Number of Pins: 2; Contact Material: Gold; Width: 5.6mm; Color: Black; RoHS: Compliant; Min Operating Temperature: -40°C; Termination: Gull Wing; Packaging: Tape and Reel; Lead Free: Lead Free; Voltage Rating: 24V; Number of Positions: 2; REACH SVHC: No SVHC; Height: 2mm; Contact Current Rating: 25mA; Length: 3.71mm; Contact Plating: Gold; Max Voltage Rating (DC): 24V; Mount: Surface Mount
SW2 = CMP-1459-00005-3: Switch Tactile Spst-no 0.05A 12V; Contact Resistance: 100mΩ; Current Rating: 50mA; Operating Force: 160N; Packaging: Tape and Reel; Width: 6mm; Voltage Rating: 12V; Min Operating Temperature: -40°C; RoHS: Compliant; Height: 4.3mm; Insulation Resistance: 100MΩ; Contact Plating: Silver; Contact Current Rating: 50mA; Max Operating Temperature: 85°C
U1 = CMP-1570-00009-1: ARM-Based Cortex-M7 32 Bit MCU+FPU, 462 DMIPS, 1024 kB Flash, 320 kB RAM, 140 I/Os, -40 to 85 degC, 176-Pin LQFP, Halogen-Free, Tray; Data RAM Size: 320 KByte; Number of I/Os: 140; Clock Frequency Max: 216 MHz; Program Memory Size: 1024 KByte; Supply Voltage Max: 3.6 V; L1 Cache Instruction Memory: 4 KByte; Supply Voltage Min: 1.7 V; PartNumber: STM32F746IG; ComponentLink1Description: Manufacturer URL; Packing: Tray; ComponentLink2Description: Datasheet; DatasheetVersion: Rev. 1; ComponentLink3URL: http://www.st.com/st-web-ui/static/active/en/resource/technical/document/datasheet/DM00035129.pdf; ComponentLink1URL: http://www.st.com/web/en/home.html; ComponentLink3Description: Package Specification; Mounting Technology: Surface Mount; L1 Cache Data Memory: 4 KByte; PackageDescription: 176-Pin Low Profile Quad Flat Package, 24 x 24 mm Body, 0.5 mm Pitch; Temperature Max: 85 degC; Temperature Min: -40 degC; ComponentLink2URL: http://www.st.com/st-web-ui/static/active/en/resource/technical/document/datasheet/DM00166116.pdf
Y1 = CMP-27762-010178-1: Crystal 25MHz ±10ppm 10pF SMD-4 3.2mm x 2.5mm; Frequency Stability: 15ppm; ESR (Equivalent Series Resistance): 50R; Mount: Surface Mount; Load Capacitance: 10pF; Frequency Tolerance: 10ppm; Max Operating Temperature: 85°C; Frequency: 25MHz; Case/Package: SMD/SMT; Length: 0.126inch; RoHS Compliant: Yes; Min Operating Temperature: -40°C; Width: 0.098inch; Height: 0.031inch; Packaging: Tape and Reel
Y2 = CMP-27762-008890-2: Crystal 32.768kHz ±20ppm (Tol) 12.5pF FUND 90kΩ 2-Pin SMD T/R; Series Resistance: 90kR; Length: 1.6mm; Package Quantity: 3000; Packaging: Tape and Reel; Max Operating Temperature: 85°C; Lead Free: Lead Free; Tolerance: 20ppm; Frequency: 32.768kHz; Termination: SMD/SMT; REACH SVHC: No SVHC; Width: 1mm; Min Operating Temperature: -40°C; RoHS Compliant: Yes; Case/Package: CSMD; ESR (Equivalent Series Resistance): 90kR; Number of Pins: 2; Height: 0.5mm; Series: ABS05; Load Capacitance: 12.5pF; Frequency Tolerance: 20ppm; Depth: 1mm; Operating Frequency: 32.768 kHz; Mount: Surface Mount; Radiation Hardening: No